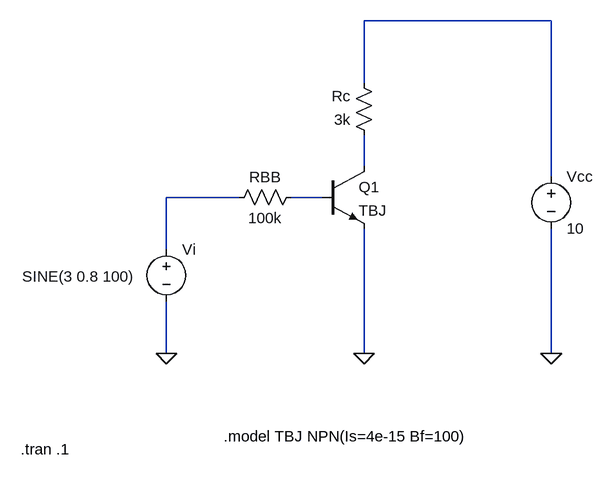
[diagram p0: schematic TBJ - Pequenos Sinais - Exemplo 1.asc]
TBJ - Pequenos Sinais - Exemplo 1.asc, the LTspice schematic file:
Version 4
SHEET 1 880 680
WIRE 496 -96 208 -96
WIRE 208 0 208 -96
WIRE 208 128 208 80
WIRE 496 144 496 -96
WIRE 16 176 -96 176
WIRE 144 176 96 176
WIRE -96 256 -96 176
WIRE -96 416 -96 336
WIRE 208 416 208 224
WIRE 496 416 496 224
FLAG 208 416 0
FLAG -96 416 0
FLAG 496 416 0
SYMBOL npn 144 128 R0
SYMATTR InstName Q1
SYMATTR Value TBJ
SYMBOL res 112 160 R90
WINDOW 0 0 56 VBottom 2
WINDOW 3 32 56 VTop 2
SYMATTR InstName RBB
SYMATTR Value 100k
SYMBOL res 224 96 R180
WINDOW 0 36 76 Left 2
WINDOW 3 36 40 Left 2
SYMATTR InstName Rc
SYMATTR Value 3k
SYMBOL voltage -96 240 R0
WINDOW 3 -222 58 Left 2
WINDOW 123 0 0 Left 0
WINDOW 39 0 0 Left 0
SYMATTR InstName Vi
SYMATTR Value SINE(3 0.8 100)
SYMBOL voltage 496 128 R0
SYMATTR InstName Vcc
SYMATTR Value 10
TEXT -8 544 Left 2 !.model TBJ NPN(Is=4e-15 Bf=100)
TEXT -320 564 Left 2 !.tran .1

The netlist it stands for:
* TBJ - Pequenos Sinais - Exemplo 1.asc
Q1 N002 N004 0 0 TBJ
RBB N004 N003 100k
Rc N002 N001 3k
Vi N003 0 SINE(3 0.8 100)
Vcc N001 0 10
.model NPN NPN
.model PNP PNP
.lib standard.bjt
.model TBJ NPN(Is=4e-15 Bf=100)
.tran .1
.backanno
.end